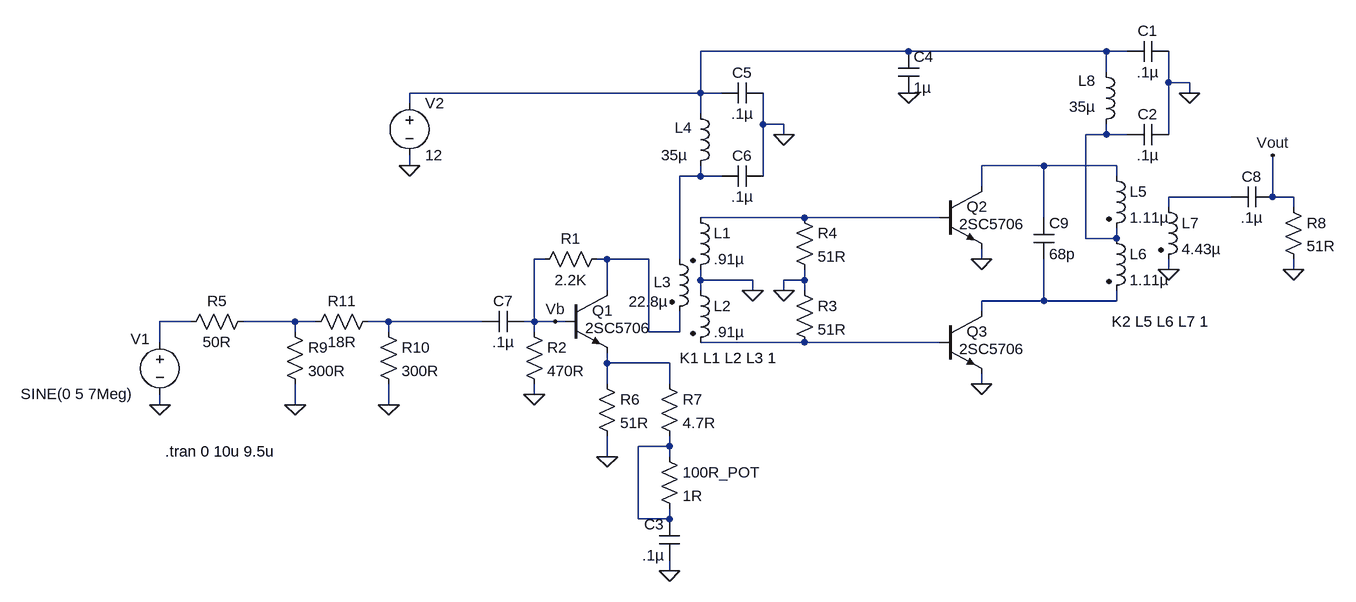
[diagram p0: schematic 2SC5706 Kits and Parts.asc]
2SC5706 Kits and Parts.asc, the LTspice schematic file:
Version 4
SHEET 1 1540 680
WIRE 880 -224 560 -224
WIRE 1184 -224 880 -224
WIRE 1216 -224 1184 -224
WIRE 1184 -192 1184 -224
WIRE 1280 -176 1280 -224
WIRE 1312 -176 1280 -176
WIRE 560 -160 560 -224
WIRE 560 -160 112 -160
WIRE 592 -160 560 -160
WIRE 1312 -160 1312 -176
WIRE 112 -144 112 -160
WIRE 560 -128 560 -160
WIRE 656 -112 656 -160
WIRE 688 -112 656 -112
WIRE 688 -96 688 -112
WIRE 1184 -96 1184 -112
WIRE 1184 -96 1152 -96
WIRE 1216 -96 1184 -96
WIRE 1280 -96 1280 -176
WIRE 112 -48 112 -64
WIRE 1088 -48 992 -48
WIRE 1200 -48 1088 -48
WIRE 560 -32 560 -48
WIRE 560 -32 528 -32
WIRE 592 -32 560 -32
WIRE 656 -32 656 -112
WIRE 1200 -32 1200 -48
WIRE 992 -16 992 -48
WIRE 1376 0 1280 0
WIRE 1440 0 1440 -64
WIRE 1472 0 1440 0
WIRE 1280 16 1280 0
WIRE 1472 16 1472 0
WIRE 720 32 560 32
WIRE 928 32 720 32
WIRE 1088 32 1088 -48
WIRE 1152 64 1152 -96
WIRE 1200 64 1200 48
WIRE 1200 64 1152 64
WIRE 320 96 304 96
WIRE 416 96 400 96
WIRE 480 96 416 96
WIRE 528 96 528 -32
WIRE 992 96 992 80
WIRE 1280 112 1280 96
WIRE 1472 112 1472 96
WIRE 560 128 560 112
WIRE 640 128 560 128
WIRE 720 128 720 112
WIRE 720 128 688 128
WIRE 416 144 416 96
WIRE 560 144 560 128
WIRE 640 144 640 128
WIRE 688 144 688 128
WIRE 720 144 720 128
WIRE 1088 160 1088 96
WIRE 1088 160 992 160
WIRE 1200 160 1200 144
WIRE 1200 160 1088 160
WIRE 992 176 992 160
WIRE -224 192 -272 192
WIRE -64 192 -144 192
WIRE -32 192 -64 192
WIRE 80 192 48 192
WIRE 224 192 80 192
WIRE 304 192 304 96
WIRE 304 192 288 192
WIRE 336 192 304 192
WIRE 352 192 336 192
WIRE -64 208 -64 192
WIRE 80 208 80 192
WIRE 304 208 304 192
WIRE 480 208 480 96
WIRE 528 208 528 176
WIRE 528 208 480 208
WIRE -272 224 -272 192
WIRE 720 224 560 224
WIRE 928 224 720 224
WIRE 416 256 416 240
WIRE 512 256 416 256
WIRE 416 288 416 256
WIRE 512 288 512 256
WIRE 992 288 992 272
WIRE 304 304 304 288
WIRE -272 320 -272 304
WIRE -64 320 -64 288
WIRE 80 320 80 288
WIRE 512 384 512 368
WIRE 512 384 464 384
WIRE 416 400 416 368
WIRE 512 400 512 384
WIRE 464 496 464 384
WIRE 512 496 512 480
WIRE 512 496 464 496
WIRE 512 576 512 560
FLAG 112 -48 0
FLAG -272 320 0
FLAG 304 304 0
FLAG 336 192 Vb
FLAG 688 -96 0
FLAG 512 576 0
FLAG 416 400 0
FLAG 640 144 0
FLAG 688 144 0
FLAG 992 96 0
FLAG 992 288 0
FLAG 1312 -160 0
FLAG 880 -160 0
FLAG 1280 112 0
FLAG 1472 112 0
FLAG -64 320 0
FLAG 80 320 0
FLAG 1440 -64 Vout
SYMBOL npn 352 144 R0
WINDOW 0 41 31 Left 2
WINDOW 3 30 58 Left 2
SYMATTR InstName Q1
SYMATTR Value 2SC5706
SYMBOL voltage -272 208 R0
WINDOW 0 -45 11 Left 2
WINDOW 3 -214 95 Left 2
WINDOW 123 0 0 Left 0
WINDOW 39 0 0 Left 0
SYMATTR InstName V1
SYMATTR Value SINE(0 5 7Meg)
SYMBOL voltage 112 -160 R0
WINDOW 123 0 0 Left 0
WINDOW 39 0 0 Left 0
SYMATTR InstName V2
SYMATTR Value 12
SYMBOL res 288 192 R0
SYMATTR InstName R2
SYMATTR Value 470R
SYMBOL cap 528 560 R180
WINDOW 0 24 56 Left 2
WINDOW 3 24 8 Left 2
SYMATTR InstName C3
SYMATTR Value .1µ
SYMBOL ind2 544 16 R0
SYMATTR InstName L1
SYMATTR Value .91µ
SYMATTR Type ind
SYMBOL res 704 128 R0
SYMATTR InstName R3
SYMATTR Value 51R
SYMBOL ind2 512 80 R0
WINDOW 0 -24 51 Left 2
WINDOW 3 -63 81 Left 2
SYMATTR InstName L3
SYMATTR Value 22.8µ
SYMATTR Type ind
SYMBOL cap 656 -176 R90
WINDOW 0 0 32 VBottom 2
WINDOW 3 32 32 VTop 2
SYMATTR InstName C5
SYMATTR Value .1µ
SYMBOL cap 288 176 R90
WINDOW 0 0 32 VBottom 2
WINDOW 3 32 32 VTop 2
SYMATTR InstName C7
SYMATTR Value .1µ
SYMBOL ind2 544 128 R0
SYMATTR InstName L2
SYMATTR Value .91µ
SYMATTR Type ind
SYMBOL res 704 16 R0
SYMATTR InstName R4
SYMATTR Value 51R
SYMBOL ind 544 -144 R0
WINDOW 0 -24 37 Left 2
WINDOW 3 -45 80 Left 2
SYMATTR InstName L4
SYMATTR Value 35µ
SYMBOL cap 656 -48 R90
WINDOW 0 0 32 VBottom 2
WINDOW 3 32 32 VTop 2
SYMATTR InstName C6
SYMATTR Value .1µ
SYMBOL res 400 272 R0
SYMATTR InstName R6
SYMATTR Value 51R
SYMBOL res 496 272 R0
SYMATTR InstName R7
SYMATTR Value 4.7R
SYMBOL res 496 384 R0
SYMATTR InstName 100R_POT
SYMATTR Value 1R
SYMBOL res 416 80 R90
WINDOW 0 0 56 VBottom 2
WINDOW 3 32 56 VTop 2
SYMATTR InstName R1
SYMATTR Value 2.2K
SYMBOL res -128 176 R90
WINDOW 0 0 56 VBottom 2
WINDOW 3 32 56 VTop 2
SYMATTR InstName R5
SYMATTR Value 50R
SYMBOL npn 928 -16 R0
WINDOW 0 41 31 Left 2
WINDOW 3 30 58 Left 2
SYMATTR InstName Q2
SYMATTR Value 2SC5706
SYMBOL npn 928 176 R0
WINDOW 0 41 31 Left 2
WINDOW 3 30 58 Left 2
SYMATTR InstName Q3
SYMATTR Value 2SC5706
SYMBOL ind2 1184 -48 R0
SYMATTR InstName L5
SYMATTR Value 1.11µ
SYMATTR Type ind
SYMBOL ind2 1184 48 R0
SYMATTR InstName L6
SYMATTR Value 1.11µ
SYMATTR Type ind
SYMBOL ind2 1264 0 R0
SYMATTR InstName L7
SYMATTR Value 4.43µ
SYMATTR Type ind
SYMBOL cap 1280 -240 R90
WINDOW 0 0 32 VBottom 2
WINDOW 3 32 32 VTop 2
SYMATTR InstName C1
SYMATTR Value .1µ
SYMBOL ind 1168 -208 R0
WINDOW 0 -27 29 Left 2
WINDOW 3 -41 69 Left 2
SYMATTR InstName L8
SYMATTR Value 35µ
SYMBOL cap 1280 -112 R90
WINDOW 0 0 32 VBottom 2
WINDOW 3 32 32 VTop 2
SYMATTR InstName C2
SYMATTR Value .1µ
SYMBOL cap 864 -224 R0
SYMATTR InstName C4
SYMATTR Value 1µ
SYMBOL cap 1440 -16 R90
WINDOW 0 0 32 VBottom 2
WINDOW 3 32 32 VTop 2
SYMATTR InstName C8
SYMATTR Value .1µ
SYMBOL res 1456 0 R0
SYMATTR InstName R8
SYMATTR Value 51R
SYMBOL cap 1072 32 R0
SYMATTR InstName C9
SYMATTR Value 68p
SYMBOL res -80 192 R0
SYMATTR InstName R9
SYMATTR Value 300R
SYMBOL res 64 192 R0
SYMATTR InstName R10
SYMATTR Value 300R
SYMBOL res 64 176 R90
WINDOW 0 0 56 VBottom 2
WINDOW 3 32 56 VTop 2
SYMATTR InstName R11
SYMATTR Value 18R
TEXT -264 392 Left 2 !.tran 0 10u 9.5u
TEXT 528 248 Left 2 !K1 L1 L2 L3 1
TEXT 1192 192 Left 2 !K2 L5 L6 L7 1

The netlist it stands for:
* 2SC5706 Kits and Parts.asc
Q1 N007 Vb N013 0 2SC5706
V1 N009 0 SINE(0 5 7Meg)
V2 N001 0 12
R2 Vb 0 470R
C3 0 N014 .1µ
L1 N006 0 .91µ
R3 0 N012 51R
L3 N004 N007 22.8µ
C5 0 N001 .1µ
C7 Vb N011 .1µ
L2 0 N012 .91µ
R4 N006 0 51R
L4 N001 N004 35µ
C6 0 N004 .1µ
R6 N013 0 51R
R7 N013 N014 4.7R
R§100R_POT N014 N014 1R
R1 N007 Vb 2.2K
R5 N010 N009 50R
Q2 N003 N006 0 0 2SC5706
Q3 N008 N012 0 0 2SC5706
L5 N003 N002 1.11µ
L6 N002 N008 1.11µ
L7 N005 0 4.43µ
C1 0 N001 .1µ
L8 N001 N002 35µ
C2 0 N002 .1µ
C4 N001 0 1µ
C8 Vout N005 .1µ
R8 Vout 0 51R
C9 N003 N008 68p
R9 N010 0 300R
R10 N011 0 300R
R11 N011 N010 18R
.model NPN NPN
.model PNP PNP
.lib standard.bjt
.tran 0 10u 9.5u
K1 L1 L2 L3 1
K2 L5 L6 L7 1
.backanno
.end